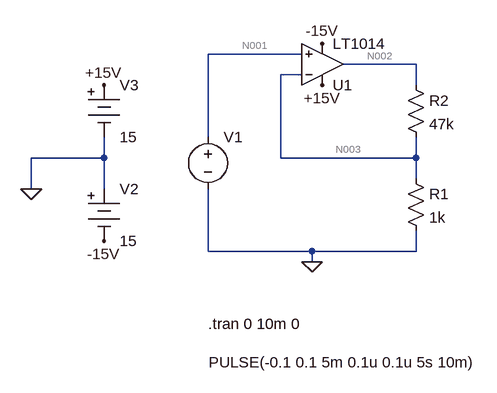
[diagram p0: schematic aufgabe1_nichtinvertierender_verstaerker_square.asc]
aufgabe1_nichtinvertierender_verstaerker_square.asc, the LTspice schematic file:
Version 4
SHEET 1 880 680
WIRE 160 144 16 144
WIRE 336 160 224 160
WIRE 160 176 128 176
WIRE 336 192 336 160
WIRE 16 272 16 144
WIRE -144 304 -144 272
WIRE -144 304 -256 304
WIRE 128 304 128 176
WIRE 336 304 336 272
WIRE 336 304 128 304
WIRE 336 336 336 304
WIRE -256 352 -256 304
WIRE -144 352 -144 304
WIRE 16 448 16 352
WIRE 176 448 16 448
WIRE 336 448 336 416
WIRE 336 448 176 448
WIRE 176 464 176 448
FLAG 176 464 0
FLAG 192 192 +15V
FLAG 192 128 -15V
FLAG -256 352 0
FLAG -144 432 -15V
FLAG -144 192 +15V
SYMBOL Opamps\\LT1014 192 224 M180
SYMATTR InstName U1
SYMBOL voltage 16 256 R0
WINDOW 123 0 0 Left 2
WINDOW 39 0 0 Left 2
WINDOW 3 1 363 Left 2
SYMATTR Value PULSE(-0.1 0.1 5m 0.1u 0.1u 5s 10m)
SYMATTR InstName V1
SYMBOL Misc\\battery -144 336 R0
WINDOW 123 0 0 Left 2
WINDOW 39 0 0 Left 2
SYMATTR InstName V2
SYMATTR Value 15
SYMBOL Misc\\battery -144 176 R0
WINDOW 123 0 0 Left 2
WINDOW 39 0 0 Left 2
SYMATTR InstName V3
SYMATTR Value 15
SYMBOL res 320 320 R0
SYMATTR InstName R1
SYMATTR Value 1k
SYMBOL res 320 176 R0
SYMATTR InstName R2
SYMATTR Value 47k
TEXT 16 560 Left 2 !.tran 0 10m 0

The netlist it stands for:
* aufgabe1_nichtinvertierender_verstaerker_square.asc
XU1 N001 N003 +15V -15V N002 LT1014  ; pins In+ In- V+ V- OUT
V1 N001 0 PULSE(-0.1 0.1 5m 0.1u 0.1u 5s 10m)
V2 0 -15V 15
V3 +15V 0 15
R1 N003 0 1k
R2 N002 N003 47k
.tran 0 10m 0
.backanno
.end

* Results of the author's LTspice run, read from the files saved beside the schematic
* Operating Point, zero values left out:
*   V(n003) = -100 mV
*   V(n001) = -100 mV
*   V(+15v) = 15 V
*   V(-15v) = -15 V
*   V(n002) = -4.801 V
*   I(R2) = -100 µA
*   I(R1) = -100 µA
*   I(V3) = -301.8 µA
*   I(V2) = -401.8 µA
*   I(V1) = 12.03 nA
*   Ix(u1:1) = -12.03 nA
*   Ix(u1:2) = -12.03 nA
*   Ix(u1:3) = 301.8 µA
*   Ix(u1:4) = -401.8 µA
*   Ix(u1:5) = 100 µA
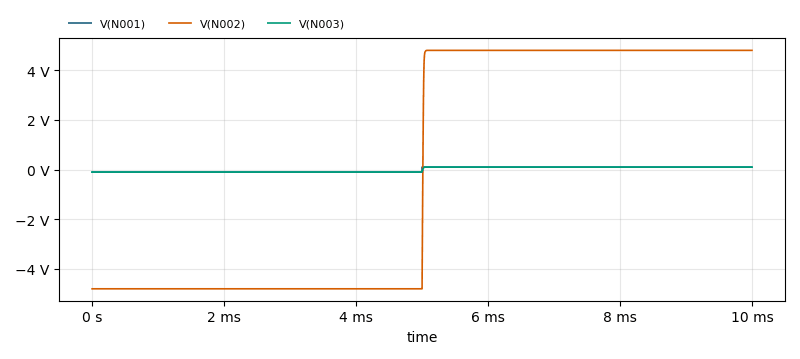
[diagram p1: Transient Analysis of aufgabe1_nichtinvertierender_verstaerker_square.asc, plotted from the saved traces]
* Transient Analysis, 1 run:
*   V(N001): min -100 mV, max 100 mV, average -1 µV, rms 100 mV, last 100 mV
*   V(N002): min -4.801 V, max 4.799 V, average -13.85 mV, rms 4.795 V, last 4.799 V
*   V(N003): min -100 mV, max 100 mV, average -276.8 µV, rms 99.89 mV, last 100 mV